# Altium schematic sheet Main.SchDoc
size A; SheetNumber: 1; SheetTotal: 1
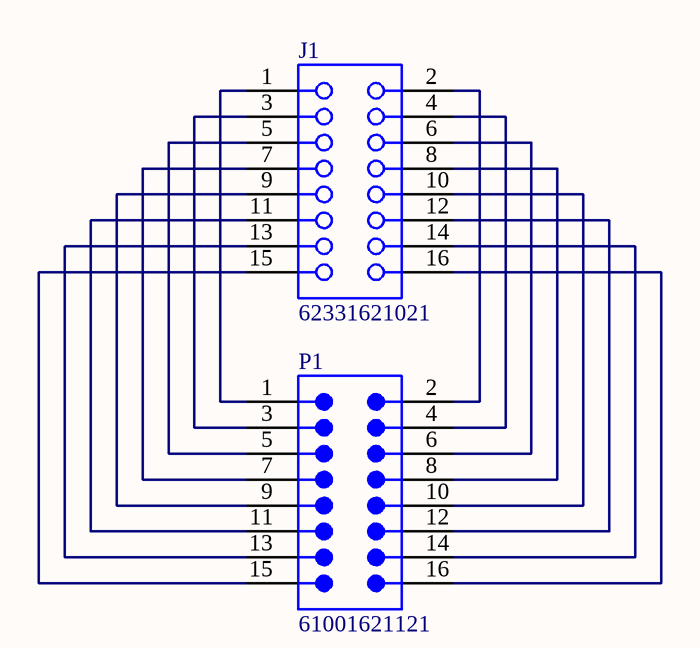
[diagram p0: Main.SchDoc]

## Parts
J1  62331621021  [62301621021]
P1  61001621121  [61001621121]

## Nets
NetJ1_1: J1.1 P1.1
NetJ1_2: J1.2 P1.2
NetJ1_3: J1.3 P1.3
NetJ1_4: J1.4 P1.4
NetJ1_5: J1.5 P1.5
NetJ1_6: J1.6 P1.6
NetJ1_7: J1.7 P1.7
NetJ1_8: J1.8 P1.8
NetJ1_9: J1.9 P1.9
NetJ1_10: J1.10 P1.10
NetJ1_11: J1.11 P1.11
NetJ1_12: J1.12 P1.12
NetJ1_13: J1.13 P1.13
NetJ1_14: J1.14 P1.14
NetJ1_15: J1.15 P1.15
NetJ1_16: J1.16 P1.16

## Library data of the parts
J1 = CMP-1502-01190-4: SMT Vertical Socket Header WR-PHD, Pitch 1.27 mm, Dual Row, 16 pins; Operating Supply Voltage: 250V; Gender: Female; Contact Resistance: 20mΩ; Current Rating: 1A; Lead Pitch: 1.27mm; Number of Pins: 16; Orientation: Vertical
P1 = CMP-1502-01034-4: SMT Vertical Pin Header WR-PHD, Pitch 2.54 mm, Dual Row, 16 pins; Contact Resistance: 20mΩ; Current Rating: 3A; Row Spacing: 2.54mm; Connector Type: Male Pin; Gender: Male; Operating Supply Voltage: 250V; Number of Contacts: 16; Min Operating Temperature: -40°C; Orientation: Vertical; Lead Pitch: 2.54mm; Contact Material: Gold; Mount: Surface Mount; Contact Mating Length: 5.9944mm; Number of Pins: 16; Height: 10mm; Termination: Solder; Color: Black; Number of Rows: 2; Number of Positions: 16; Pitch: 2.54mm; Contact Plating: Gold; RoHS: Compliant; Voltage Rating: 250V; Max Operating Temperature: 105°C